# Altium project Tag105.Rev21.PrjPCB
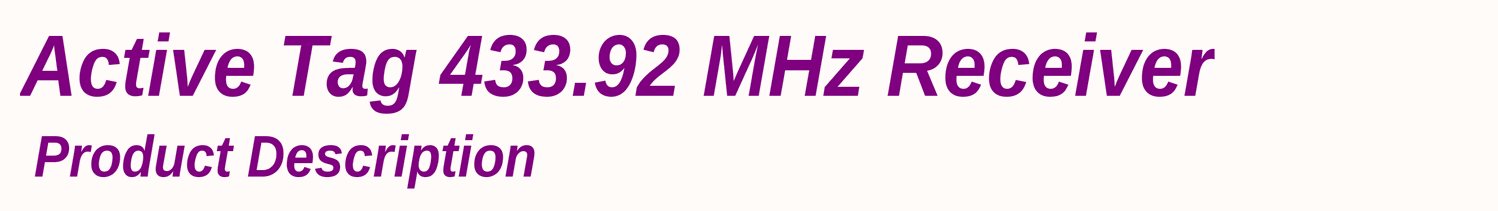
[diagram p0: PG01 Opening Page.SchDoc]
4 sheets, 91 parts. Net scope: global (net labels, ports and power ports of the same name join across sheets).
Sheets:
  PG01 Opening Page.SchDoc
  PG02 Index and Revs.SchDoc
  PG3 SHEET1.schdoc
  PG4 SHEET2.schdoc

## Sheet PG01 Opening Page.SchDoc: Opening Page
size B; Date: 2/10/2009; ApprovedBy: Touraj; DrawnBy: Juan A. Nadal; Engineer: Touraj; Organization: ActiveWave; Address1: 902 Clint Moore Rd., Suite 118; Address2: Boca Raton; Address3: FL, 33487; Address4: 561-999-9422; DocumentNumber: 1; Revision: 21; SheetNumber: 1; SheetTotal: 4; PageSetup: Record=PageOptions|CenterHorizontal=True|CenterVertical=True|PrintScale=0.68|XCorrection=1.00|YCorrection=1.00|PrintKind=0|BorderSize=5000000|LeftOffset=0|BottomOffset=0|Orientation=2|PaperLength=1000|PaperWidth=1000|Scale=100|PaperSource=7|PrintQuality=-4|MediaType=1|DitherType=10|PaperKind=Letter (8.5 x 11 in.)|PrintScaleMode=1; Project: Tag105

### Notes on the sheet
- Active Tag 433.92 MHz Receiver
- Product Description
- APPROVALS
- DATE
- Title:
- Drawn:
- Checked:
- Release:
- Date:
- Size:
- Sheet Name:
- B
- Number:
- Time:
- Revision:
- Sheet
- of
- File:

## Sheet PG02 Index and Revs.SchDoc: Index and Revisions
size B; Date: 2/10/2009; ApprovedBy: Touraj; DrawnBy: Juan A. Nadal; Engineer: Touraj; Organization: ActiveWave; Address1: 902 Clint Moore Rd., Suite 118; Address2: Boca Raton; Address3: FL, 33487; Address4: 561-999-9422; DocumentNumber: 2; Revision: 21; SheetNumber: 2; SheetTotal: 4; PageSetup: Record=PageOptions|CenterHorizontal=True|CenterVertical=True|PrintScale=0.68|XCorrection=1.00|YCorrection=1.00|PrintKind=0|BorderSize=5000000|LeftOffset=0|BottomOffset=0|Orientation=2|PaperLength=1000|PaperWidth=1000|Scale=100|PaperSource=7|PrintQuality=-4|MediaType=1|DitherType=10|PaperKind=Letter|PrintScaleMode=1; Project: Tag105
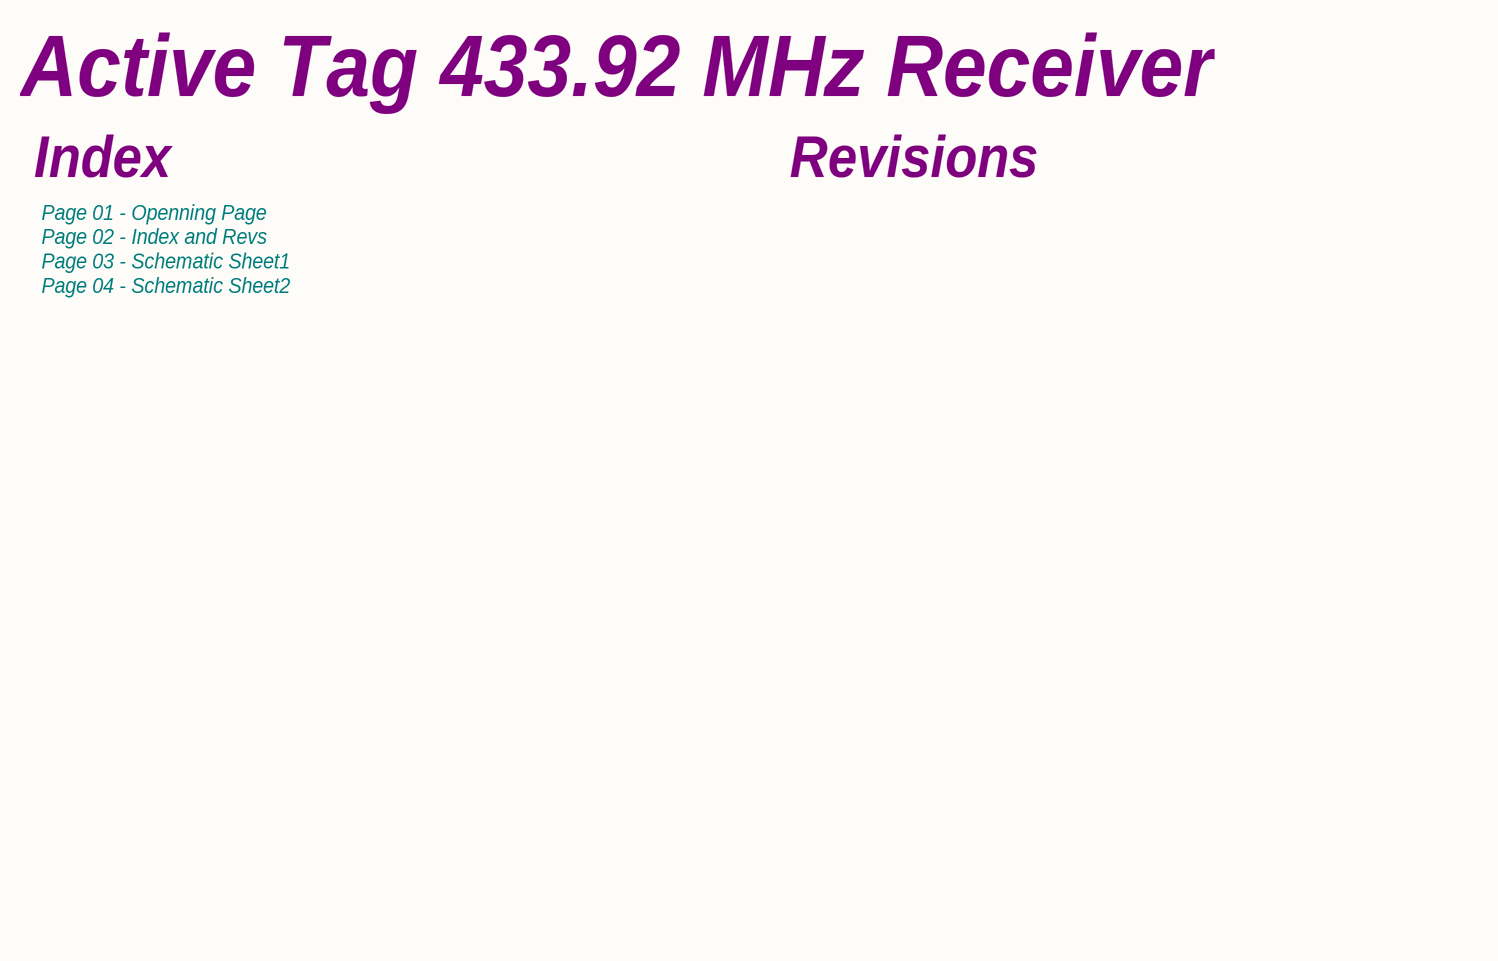
[diagram p1: PG02 Index and Revs.SchDoc]

### Notes on the sheet
- Active Tag 433.92 MHz Receiver
- Index
- Revisions
- Page 01 - Openning Page
  Page 02 - Index and Revs
  Page 03 - Schematic Sheet1
  Page 04 - Schematic Sheet2
- APPROVALS
- DATE
- Title:
- Drawn:
- Checked:
- Release:
- Date:
- Size:
- Sheet Name:
- B
- Number:
- Time:
- Revision:
- Sheet
- of
- File:

## Sheet PG3 SHEET1.schdoc
size B; Date: 2/10/2009; ApprovedBy: Touraj; DrawnBy: Juan A. Nadal; Engineer: Touraj; Organization: ActiveWave; Address1: 902 Clint Moore Rd., Suite 118; Address2: Boca Raton; Address3: FL, 33487; Address4: 561-999-9422; DocumentNumber: 3; Revision: 21; SheetNumber: 3; SheetTotal: 4; PageSetup: Record=PageOptions|CenterHorizontal=True|CenterVertical=True|PrintScale=0.70|XCorrection=1.00|YCorrection=1.00|PrintKind=0|BorderSize=5000000|LeftOffset=0|BottomOffset=0|Orientation=2|PaperLength=1000|PaperWidth=1000|Scale=100|PaperSource=7|PrintQuality=-4|MediaType=1|DitherType=10|PaperKind=Letter|PrintScaleMode=1; Project: Tag105
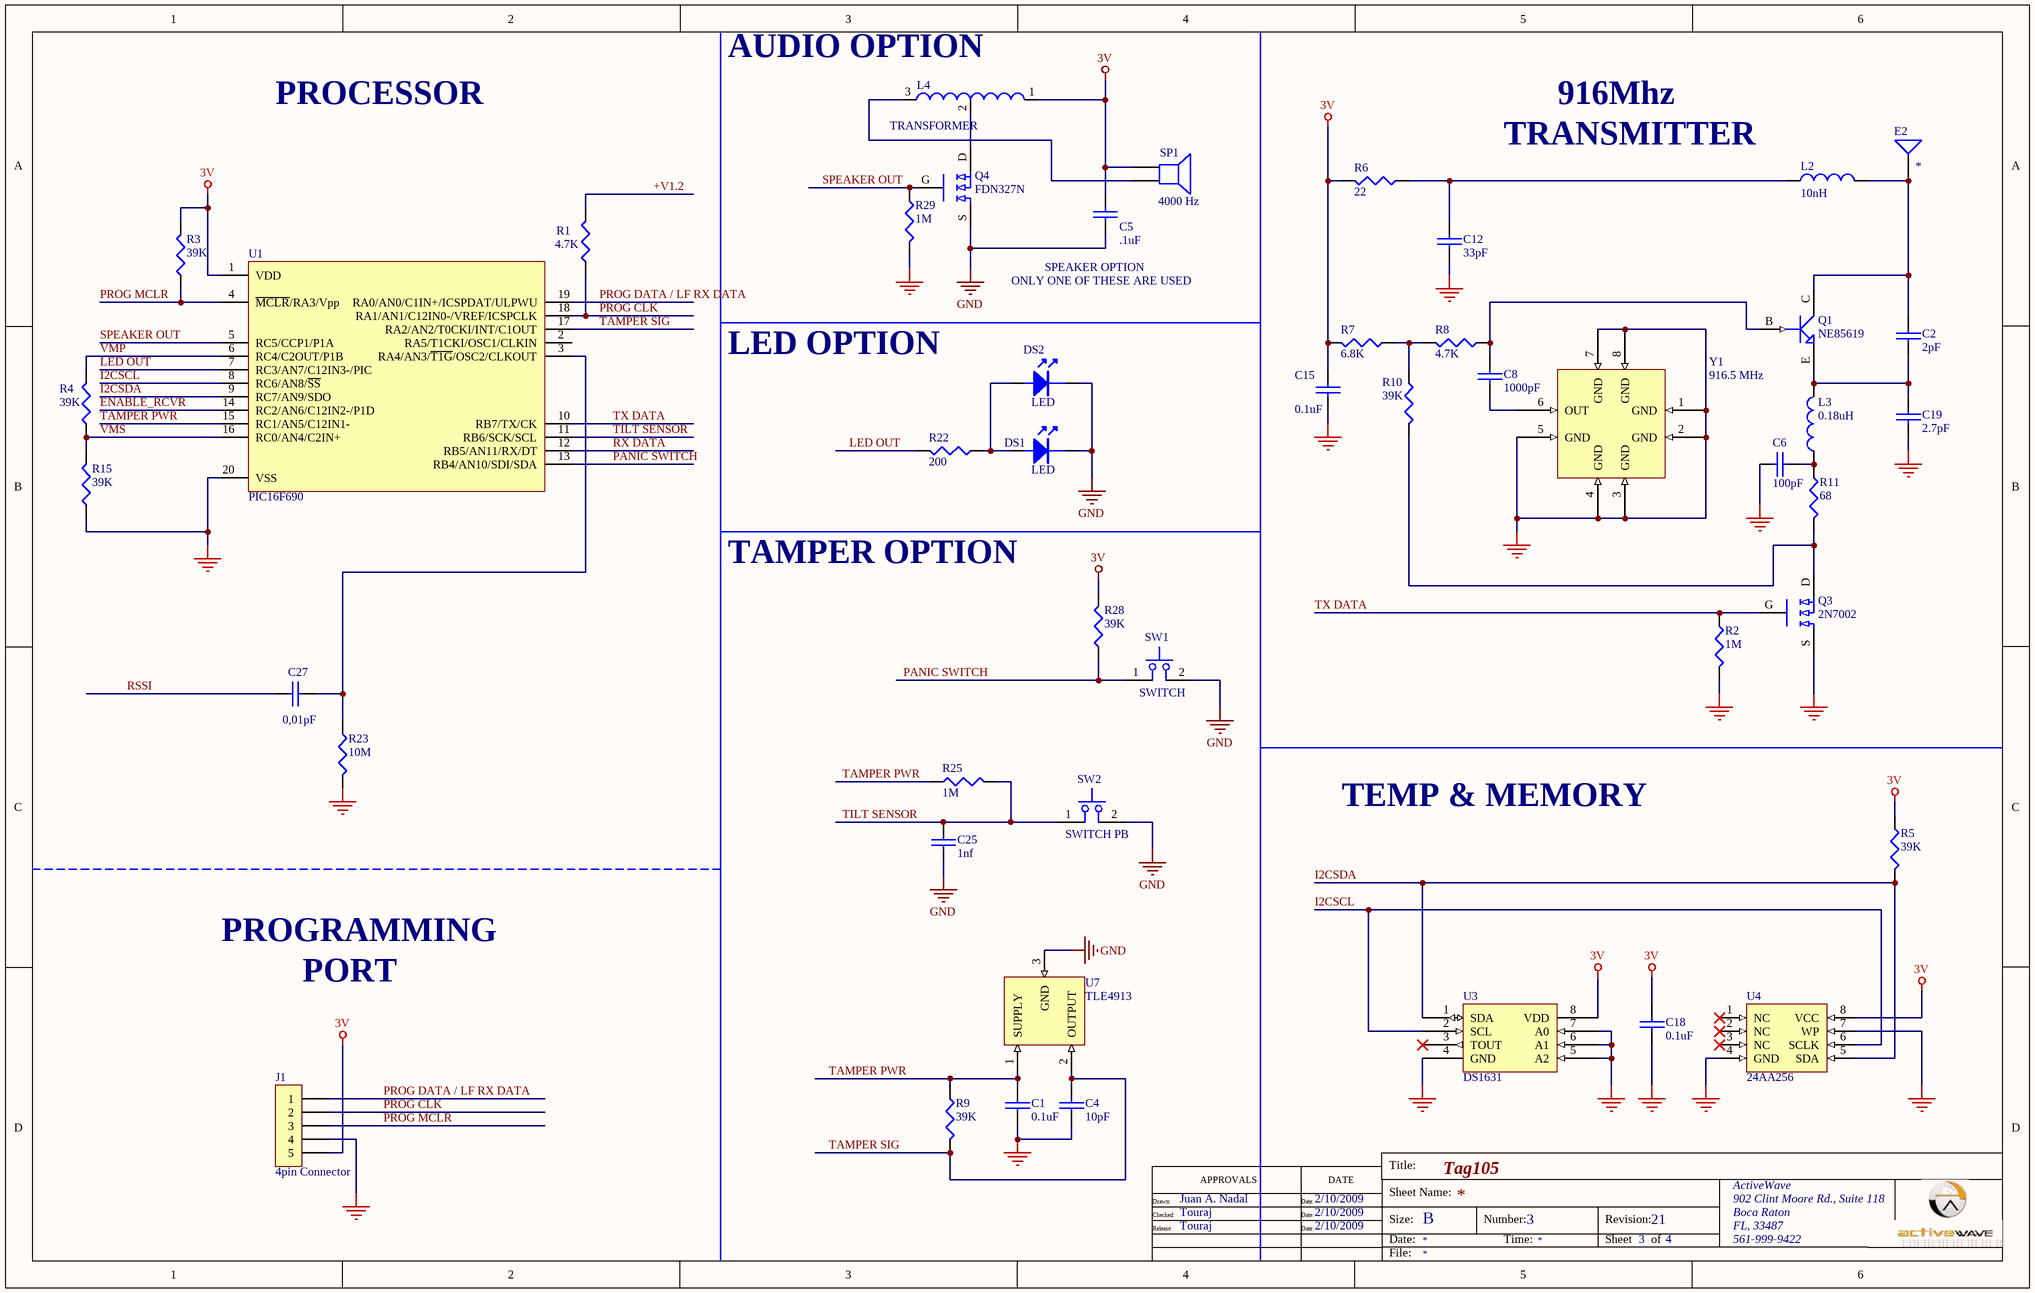
[diagram p2: PG3 SHEET1.schdoc]

### Parts
C1  0.1uF  [0603]
C2  2pF  [0603]
C4  10pF  [0603]
C5  .1uF  [0603]
C6  100pF  [0603]
C8  1000pF  [0603]
C12  33pF  [0603]
C15  0.1uF  [0603]
C18  0.1uF  [0603]
C19  2.7pF  [0603]
C25  1nf  [0603]
C27  0,01pF  [0603]
DS1  LED  [404-1032-2-ND]
DS2  LED  [LCE-358RP]
E2  *  [Antenna1]
J1  4pin Connector  [1X5 HEADER]
L2  10nH  [0603]
L3  0.18uH  [0603]
L4  TRANSFORMER  [COIL_6mmx6mm_011012]
Q1  NE85619  [3 PIN ULTRA SUPER MINI MOLD]
Q3  2N7002  [SOT23 FET]
Q4  FDN327N  [SOT23 FET]
R1  4.7K  [0603]
R2  1M
R3  39K  [0603]
R4  39K  [0603]
R5  39K  [0603]
R6  22
R7  6.8K
R8  4.7K
R9  39K  [0603]
R10  39K  [0603]
R11  68
R15  39K  [0603]
R22  200  [0603]
R23  10M  [0603]
R25  1M  [0603]
R28  39K  [0603]
R29  1M  [0603]
SP1  4000 Hz  [SPEAKER 12mmx12mm_011012]
SW1  SWITCH  [SWITCH PB REVERSED_082907]
SW2  SWITCH PB  [SQ-SEN-DUAL1]
U1  PIC16F690  [SSOP20 WIDE]
U3  DS1631  [SO8 SMALL]
U4  24AA256  [SO8]
U7  TLE4913  [SOT23W]
Y1  916.5 MHz  [RESONATOR]

### Nets
3V: C5.1 C15.1 C18.1 J1.5 L4.1 R3.2 R5.1 R6.2 R7.2 R28.2 SP1.1 U1.1(VDD) U3.8(VDD) U4.8(VCC)
GND: C1.2 C4.2 C5.2 C6.2 C12.2 C15.2 C18.2 C19.2 C25.2 DS1.K DS2.2 J1.4 Q3.S Q4.S R2.2 R15.1 R23.2 R29.2 SW1.2 SW2.2 U1.20(VSS) U3.4(GND) U3.5(A2) U3.6(A1) U3.7(A0) U4.4(GND) U4.7(WP) U7.3(GND) Y1.1(GND) Y1.2(GND) Y1.3(GND) Y1.4(GND) Y1.5(GND) Y1.7(GND) Y1.8(GND)
+V1.2: R1.2
ENABLE_RCVR: U1.14(RC2/AN6/C12IN2-/P1D)
I2CSCL: U1.8(RC6/AN8/~{SS}) U3.2(SCL) U4.6(SCLK)
I2CSDA: R5.2 U1.9(RC7/AN9/SDO) U3.1(SDA) U4.5(SDA)
LED OUT: R22.2 U1.7(RC3/AN7/C12IN3-/PIC)
PANIC SWITCH: R28.1 SW1.1 U1.13(RB4/AN10/SDI/SDA)
PROG CLK: J1.2 R1.1 U1.18(RA1/AN1/C12IN0-/VREF/ICSPCLK)
PROG DATA / LF RX DATA: J1.1 U1.19(RA0/AN0/C1IN+/ICSPDAT/ULPWU)
PROG MCLR: J1.3 R3.1 U1.4(~{MCLR}/RA3/Vpp)
RSSI: C27.1
RX DATA: U1.12(RB5/AN11/RX/DT)
SPEAKER OUT: Q4.G R29.1 U1.5(RC5/CCP1/P1A)
TAMPER PWR: C1.1 R9.1 R25.1 U1.15(RC1/AN5/C12IN1-) U7.1(SUPPLY)
TAMPER SIG: C4.1 R9.2 U1.17(RA2/AN2/T0CKI/INT/C1OUT) U7.2(OUTPUT)
TILT SENSOR: C25.1 R25.2 SW2.1 U1.11(RB6/SCK/SCL)
TX DATA: Q3.G R2.1 U1.10(RB7/TX/CK)
VMP: R4.2 U1.6(RC4/C2OUT/P1B)
VMS: R4.1 R15.2 U1.16(RC0/AN4/C2IN+)
NetC2_1: C2.1 E2.1 L2.2 Q1.C
NetC2_2: C2.2 C19.1 L3.2 Q1.E
NetC6_1: C6.1 L3.1 R11.1
NetC8_1: C8.1 Q1.B R8.1
NetC8_2: C8.2 Y1.6(OUT)
NetC12_1: C12.1 L2.1 R6.1
NetC27_2: C27.2 R23.1 U1.3(RA4/AN3/~{T1G}/OSC2/CLKOUT)
NetDS1_A: DS1.A DS2.1 R22.1
NetL4_2: L4.2 Q4.D
NetL4_3: L4.3 SP1.2
NetQ3_D: Q3.D R10.2 R11.2
NetR7_1: R7.1 R8.2 R10.1

Not connected (* = marked no-connect by the designer): U1 2(RA5/T1CKI/OSC1/CLKIN); U3 3(TOUT)*; U4 1(NC)* 2(NC)* 3(NC)*

### Notes on the sheet
- (near L4) AUDIO OPTION
- PROCESSOR
- TRANSMITTER
- 916Mhz
- ONLY ONE OF THESE ARE USED
- (near C5) SPEAKER OPTION
- LED OPTION
- TAMPER OPTION
- TEMP & MEMORY
- PROGRAMMING
- PORT
- APPROVALS
- DATE
- Title:
- Drawn:
- Checked:
- Release:
- Date:
- Size:
- Sheet Name:
- B
- Number:
- Time:
- Revision:
- Sheet
- of
- File:

### Library data of the parts
C1 C2 C4-C6 C8 C12 C15 C18 C19 C25 C27 = CAP-0603: Capacitor; ACTIVEWAVE-P/N: *; ITEM-DESCRIPTION: *; MANUFACTURER: *; MFGR-P/N: *
  C1 C15 C18: VALUE: 0.1uF
  C2: VALUE: 2pF
  C4: VALUE: 10pF
  C5: VALUE: .1uF
  C6: VALUE: 100pF
  C8: VALUE: 1000pF
  C12: VALUE: 33pF
  C19: VALUE: 2.7pF
  C25: VALUE: 1nf
  C27: VALUE: 0,01pF
DS2 = LCE-358RP: X-Bring Red Power SMD LED Emitter; MANUFACTURER: L.C. LED; ACTIVEWAVE-P/N: *; ITEM-DESCRIPTION: X-Bring Red Power SMD LED Emitter; MFGR-P/N: LCE-358RP; Value: LED
E2 = Antenna1: VALUE: *
J1 = CON5-1: Connector; ACTIVEWAVE-P/N: *; ITEM-DESCRIPTION: *; MANUFACTURER: *; MFGR-P/N: *; VALUE: 4pin Connector
L2 L3 = INDUCTOR: ACTIVEWAVE-P/N: *; ITEM-DESCRIPTION: *; MANUFACTURER: *; MFGR-P/N: *
  L2: VALUE: 10nH
  L3: VALUE: 0.18uH
L4 = INDUCTOR_V2: VALUE: TRANSFORMER
Q1 = NE85619: TRANSISTOR NPN 1GHZ SMD; MANUFACTURER: ??????; ACTIVEWAVE-P/N: *; ITEM-DESCRIPTION: TRANSISTOR NPN 1GHZ SMD; MFGR-P/N: ??????; VALUE: NE85619
Q3 = 2N7002: N-CHANNEL ENHANCEMENT MODE FIELD EFFECT TRANSISTOR; MANUFACTURER: FAIRCHILD; ACTIVEWAVE-P/N: *; ITEM-DESCRIPTION: N-CHANNEL ENHANCEMENT MODE FIELD EFFECT TRANSISTOR; MFGR-P/N: 2N7002; VALUE: 2N7002
Q4 = FDN327N: 20V N-Channel MOSFET; MANUFACTURER: FAIRCHILD; ITEM-DESCRIPTION: N-CHANNEL 1.8 VGS SPECIFIED POWERTRENCH MOSFET; ACTIVEWAVE-P/N: *; MFGR-P/N: FDN327N; VALUE: FDN327N
R1 = RESISTOR: Text Field1: 20; Text Field2: 30
R2 R6-R8 R11 R29 = RES-0402: ACTIVEWAVE-P/N: *; MFGR-P/N: *; MANUFACTURER: *; ITEM-DESCRIPTION: *
  R2 R29: VALUE: 1M
  R6: VALUE: 22
  R7: VALUE: 6.8K
  R8: VALUE: 4.7K
  R11: VALUE: 68
R3-R5 R9 R10 R15 R22 R23 R25 R28 = RES-0603: ACTIVEWAVE-P/N: *; MFGR-P/N: *; MANUFACTURER: *; ITEM-DESCRIPTION: *
  R3-R5 R9 R10 R15 R28: VALUE: 39K
  R22: VALUE: 200
  R23: VALUE: 10M
  R25: VALUE: 1M
SP1 = SMT-1028-S-R: Surface Mount Transducer; MANUFACTURER: PUI Audio; ITEM-DESCRIPTION: Audio Indicators & Alerts EM 98dB 2830H 3.6Vpp; ACTIVEWAVE-P/N: *; MFGR-P/N: CMT-1203; VALUE: 4000 Hz
U1 = PIC16F690-E/P: Microcontrollers (MCU) 7KB FL 256R 18 I/O; MANUFACTURER: Microchip; ACTIVEWAVE-P/N: *; ITEM-DESCRIPTION: Microcontrollers (MCU) 7KB FL 256R 18 I/O; MFGR-P/N: PIC16F690-E/P; VALUE: PIC16F690
U3 = DS1631: High-Precision Digital Thermometer and Thermostat; MANUFACTURER: DALLAS SEMICONDUCTOR; MFGR-P/N: ??????; ACTIVEWAVE-P/N: *; ITEM-DECRIPTION: High-Precision Digital Thermometer and Thermostat; VALUE: DS1631
U4 = 24AA256-I/P: 24AA256 32k Microchip Serial EEPROM; ACTIVEWAVE-P/N: *; MFGR-P/N: 24AA256-I/P; MANUFACTURER: Microchip; ITEM-DESCRIPTION: 24AA256 32k Microchip Serial EEPROM; VALUE: 24AA256
U7 = TLE4913: Low Power Hall Switch; MANUFACTURER: Infineon Technologies AG; ACTIVEWAVE-P/N: *; ITEM-DESCRIPTION: Low Power Hall Switch; MFGR-P/N: TLE4913; VALUE: TLE4913
Y1 = RESONATOR: 916.5 MHz Saw Resonator; MANUFACTURER: ??????; ACTIVEWAVE-P/N: *; ITEM-DESCRIPTION: 916.5 MHz Saw Resonator; MFGR-P/N: ??????; VALUE: 916.5 MHz
DS1 = LED: ACTIVEWAVE-P/N: *; ITEM-DESCRIPTION: *; MANUFACTURER: *; MFGR-P/N: *; VALUE: LED
SW1 = SWITCH: ACTIVEWAVE-P/N: *; ITEM-DESCRIPTION: *; MANUFACTURER: *; MFGR-P/N: *; VALUE: SWITCH
SW2 = SWITCH PB: ACTIVEWAVE-P/N: *; ITEM-DESCRIPTION: *; MANUFACTURER: *; MFGR-P/N: *; VALUE: SWITCH PB

## Sheet PG4 SHEET2.schdoc
size B; Date: 2/10/2009; ApprovedBy: Touraj; DrawnBy: Juan A. Nadal; Engineer: Touraj; Organization: ActiveWave; Address1: 902 Clint Moore Rd., Suite 118; Address2: Boca Raton; Address3: FL, 33487; Address4: 561-999-9422; DocumentNumber: 4; Revision: 21; SheetNumber: 4; SheetTotal: 4; PageSetup: Record=PageOptions|CenterHorizontal=True|CenterVertical=True|PrintScale=0.70|XCorrection=1.00|YCorrection=1.00|PrintKind=0|BorderSize=5000000|LeftOffset=0|BottomOffset=0|Orientation=2|PaperLength=1000|PaperWidth=1000|Scale=100|PaperSource=7|PrintQuality=-4|MediaType=1|DitherType=10|PaperKind=Letter|PrintScaleMode=1; Project: Tag105
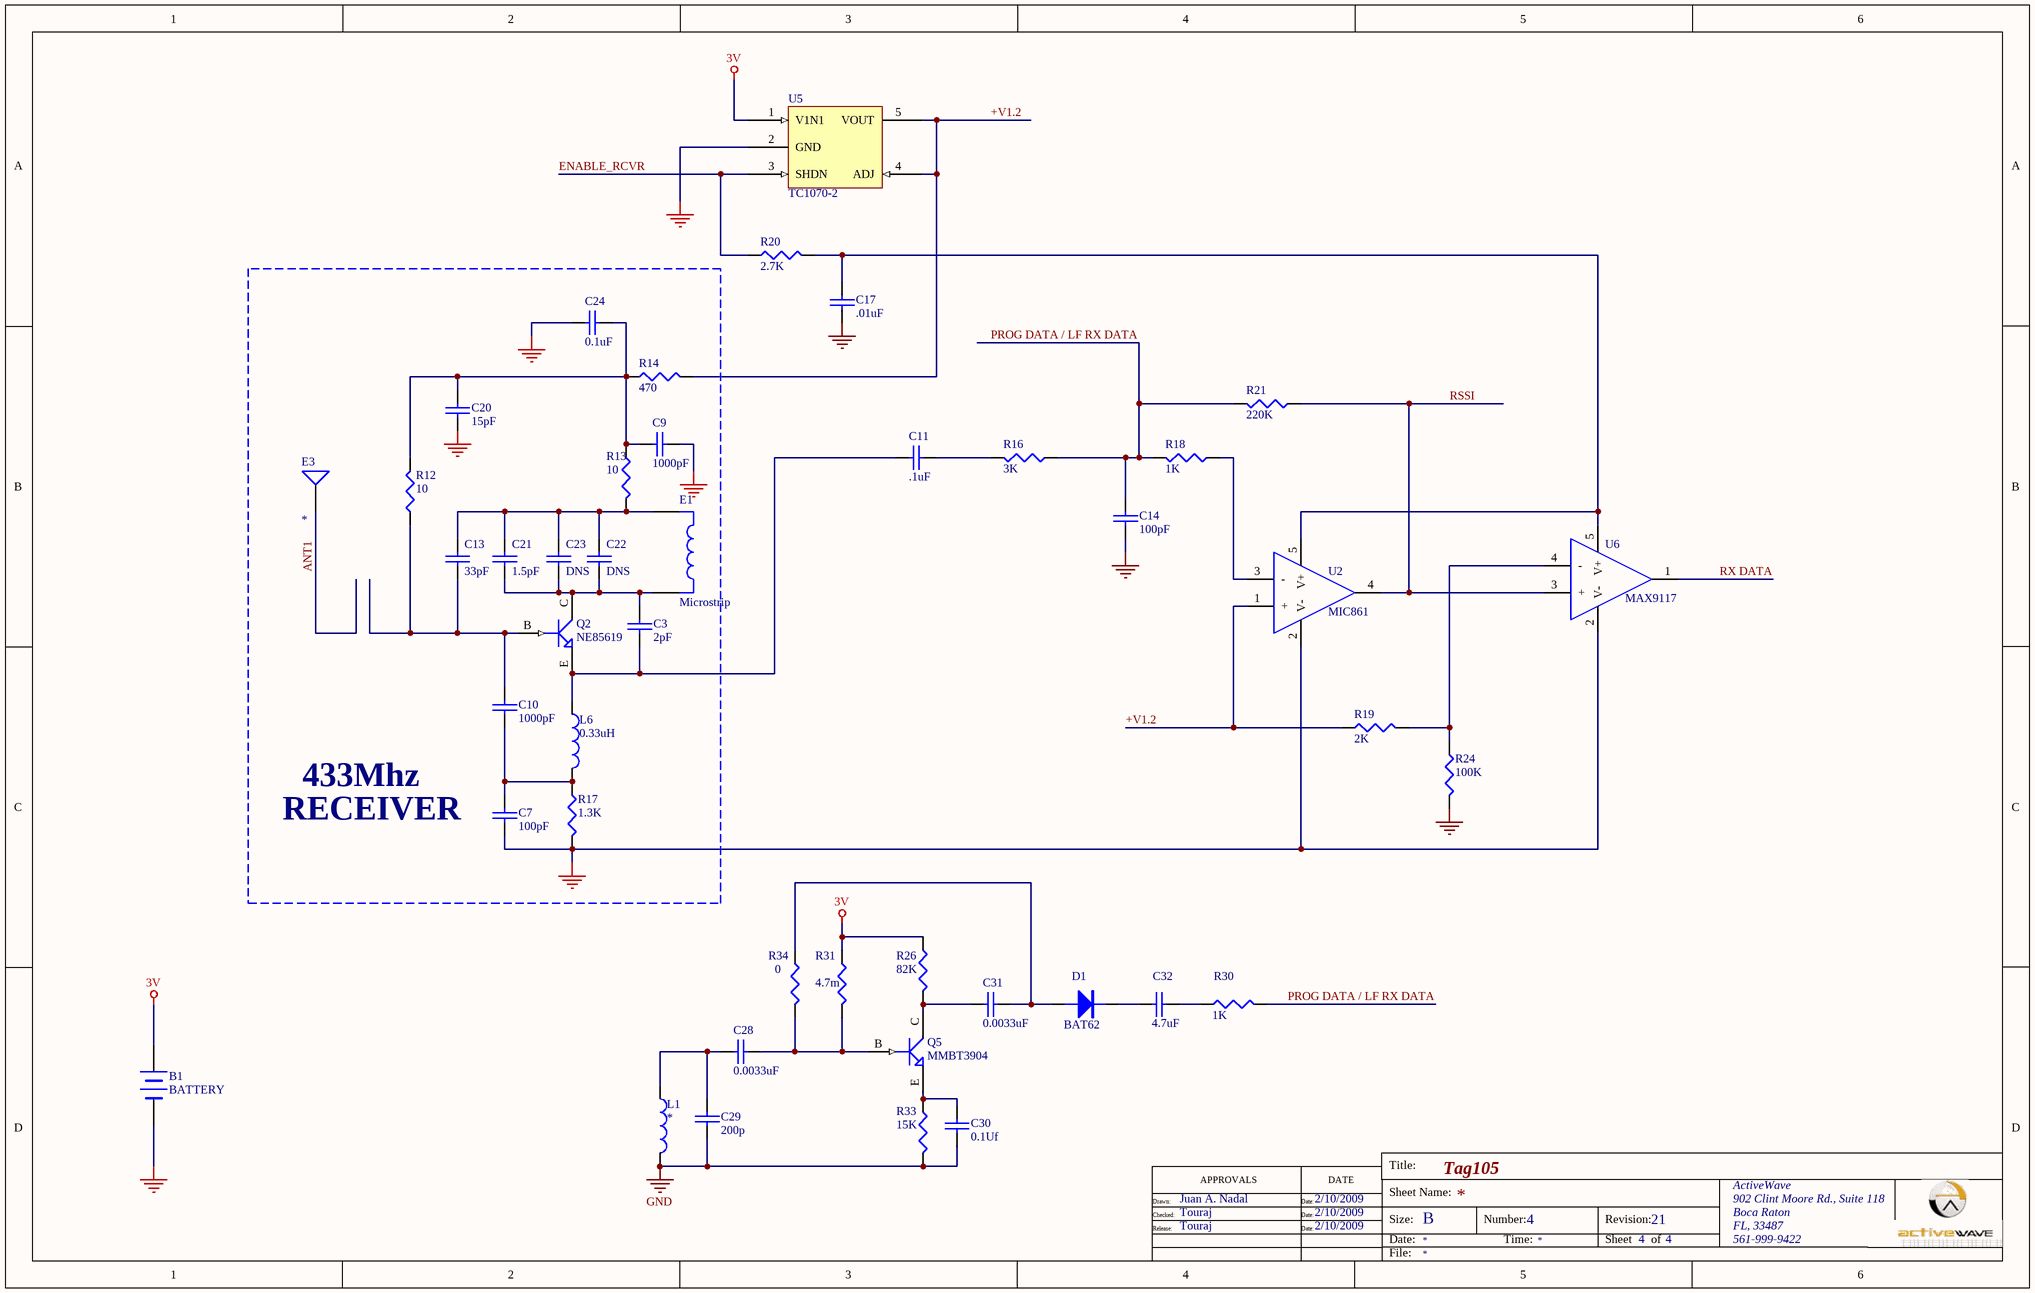
[diagram p3: PG4 SHEET2.schdoc]

### Parts
B1  BATTERY  [BATT HOLDER COIN CR2032 CUT]
C3  2pF  [0603]
C7  100pF  [0603]
C9  1000pF  [0603]
C10  1000pF  [0603]
C11  .1uF  [0603]
C13  33pF  [0603]
C14  100pF  [0603]
C17  .01uF  [0603]
C20  15pF  [0603]
C21  1.5pF  [0603]
C22  DNS  [0603]
C23  DNS  [0603]
C24  0.1uF  [0603]
C28  0.0033uF  [0603]
C29  200p  [0603]
C30  0.1Uf  [0603]
C31  0.0033uF  [0603]
C32  4.7uF  [0603]
D1  BAT62  [SMCR_SOD323_V1]
E1  Microstrip  [Antenna]  (net tie, no BOM)
E3  *  [Antenna1]
L1  *  [4308RV]
L6  0.33uH  [0603]
Q2  NE85619  [3 PIN ULTRA SUPER MINI MOLD]
Q5  MMBT3904  [SOT23-EBC]
R12  10  [0603]
R13  10  [0603]
R14  470  [0603]
R16  3K  [0603]
R17  1.3K  [0603]
R18  1K  [0603]
R19  2K  [0603]
R20  2.7K  [0603]
R21  220K  [0603]
R24  100K  [0603]
R26  82K  [0603]
R30  1K  [0603]
R31  4.7m  [0603]
R33  15K  [0603]
R34  0  [0603]
U2  MIC861  [SC70]
U5  TC1070-2  [SOT23-5A]
U6  MAX9117  [SC70]

### Nets
3V: B1.2(+) R26.1 R31.1 U5.1(V1N1)
GND: B1.1(-) C7.2 C9.2 C14.1 C17.2 C20.2 C24.2 C29.1 C30.1 L1.2 R17.2 R24.2 R33.2 U2.2(V-) U5.2(GND) U6.2(V-)
+V1.2: R14.2 R19.1 U2.1(+) U5.4(ADJ) U5.5(VOUT)
ANT1: E3.1
ENABLE_RCVR: R20.1 U5.3(SHDN)
PROG DATA / LF RX DATA: C14.2 R16.1 R18.2 R21.2 R30.2
RSSI: R21.1 U2.4(OUT) U6.3(+)
RX DATA: U6.1(OUT)
NetC3_1: C3.1 C21.2 C22.2 C23.2 E1.1 Q2.C
NetC3_2: C3.2 C11.1 L6.1 Q2.E
NetC7_1: C7.1 C10.2 L6.2 R17.1
NetC9_1: C9.1 C20.1 C24.1 R12.2 R13.1 R14.1
NetC10_1: C10.1 C13.2 Q2.B R12.1
NetC11_2: C11.2 R16.2
NetC13_1: C13.1 C21.1 C22.1 C23.1 E1.2 R13.2
NetC17_1: C17.1 R20.2 U2.5(V+) U6.5(V+)
NetC28_1: C28.1 C29.2 L1.1
NetC28_2: C28.2 Q5.B R31.2 R34.2
NetC30_2: C30.2 Q5.E R33.1
NetC31_1: C31.1 Q5.C R26.2
NetC31_2: C31.2 D1.A R34.1
NetC32_1: C32.1 D1.K
NetC32_2: C32.2 R30.1
NetR18_1: R18.1 U2.3(-)
NetR19_2: R19.2 R24.1 U6.4(-)

### Notes on the sheet
- RECEIVER
- 433Mhz
- APPROVALS
- DATE
- Title:
- Drawn:
- Checked:
- Release:
- Date:
- Size:
- Sheet Name:
- B
- Number:
- Time:
- Revision:
- Sheet
- of
- File:

### Library data of the parts
C3 C7 C9-C11 C13 C14 C17 C20-C24 C28-C32 = CAP-0603: Capacitor; ACTIVEWAVE-P/N: *; ITEM-DESCRIPTION: *; MANUFACTURER: *; MFGR-P/N: *
  C3: VALUE: 2pF
  C7 C14: VALUE: 100pF
  C9 C10: VALUE: 1000pF
  C11: VALUE: .1uF
  C13: VALUE: 33pF
  C17: VALUE: .01uF
  C20: VALUE: 15pF
  C21: VALUE: 1.5pF
  C22 C23: VALUE: DNS
  C24: VALUE: 0.1uF
  C28 C31: VALUE: 0.0033uF
  C29: VALUE: 200p
  C30: VALUE: 0.1Uf
  C32: VALUE: 4.7uF
D1 = DIODE: ACTIVEWAVE-P/N: *; ITEM-DESCRIPTION: *; MANUFACTURER: *; MFGR-P/N: *; VALUE: BAT62
E1 = ANTENNA: PART-VALUE: *; ITEM-DESCRIPTION: Microstrip
E3 = Antenna1: VALUE: *
L1 = INDUCTOR_V1: ACTIVEWAVE-P/N: *; ITEM-DESCRIPTION: *; MANUFACTURER: *; MFGR-P/N: *; VALUE: *
L6 = INDUCTOR: ACTIVEWAVE-P/N: *; ITEM-DESCRIPTION: *; MANUFACTURER: *; MFGR-P/N: *; VALUE: 0.33uH
Q2 = NE85619: as Q1 on sheet PG3 SHEET1; ACTIVEWAVE-P/N: *; ITEM-DESCRIPTION: TRANSISTOR NPN 1GHZ SMD; MFGR-P/N: ??????; VALUE: NE85619
Q5 = MMBT3904: NPN SWITCHING TRANSTOR; MANUFACTURER: ??????; ITEM-DESCRIPTION: TRANSISTOR NPN 1GHZ SMD; ACTIVEWAVE-P/N: *; MFGR-P/N: ??????; VALUE: MMBT3904
R12-R14 R16-R21 R24 R26 R30 R31 R33 R34 = RES-0603: ACTIVEWAVE-P/N: *; MFGR-P/N: *; MANUFACTURER: *; ITEM-DESCRIPTION: *
  R12 R13: VALUE: 10
  R14: VALUE: 470
  R16: VALUE: 3K
  R17: VALUE: 1.3K
  R18 R30: VALUE: 1K
  R19: VALUE: 2K
  R20: VALUE: 2.7K
  R21: VALUE: 220K
  R24: VALUE: 100K
  R26: VALUE: 82K
  R31: VALUE: 4.7m
  R33: VALUE: 15K
  R34: VALUE: 0
U2 = MIC861BC5: Ultra Low Power Op Amp; MANUFACTURER: MICREL; ACTIVEWAVE-P/N: *; ITEM-DESCRIPTION: Ultra Low Power Op Amp; MFGR-P/N: MIC861BC5; VALUE: MIC861
U5 = TC1070-2: Adjustable CMOS LDOs with Shutdown; MANUFACTURER: Microchip Technology; ITEM-DESCRIPTION: 50mA, 100mA and 150mA Adjustable CMOS LDOs with Shutdown; MFGR-P/N: TC1070; ACTIVEWAVE-P/N: *; VALUE: TC1070-2
U6 = COMPARATOR MAX9117: MAX9117 Comparators; MANUFACTURER: MAXIM; ITEM-DESCRIPTION: SC70, 1.6V, Nanopower, Beyond-the-Rails Comparators With/Without Reference; MFGR-P/N: ??????; ACTIVEWAVE-P/N: *; VALUE: MAX9117
B1 = BATTERY: ACTIVEWAVE-P/N: *; ITEM-DESCRIPTION: *; MANUFACTURER: *; MFGR-P/N: *; VALUE: BATTERY

## Nets that join several sheets
3V: PG3 SHEET1 (14 pins), PG4 SHEET2 (B1.2 R26.1 R31.1 U5.1)
GND: PG3 SHEET1 (35 pins), PG4 SHEET2 (16 pins)
+V1.2: PG3 SHEET1 (R1.2), PG4 SHEET2 (5 pins)
ENABLE_RCVR: PG3 SHEET1 (U1.14), PG4 SHEET2 (R20.1 U5.3)
PROG DATA / LF RX DATA: PG3 SHEET1 (J1.1 U1.19), PG4 SHEET2 (5 pins)
RSSI: PG3 SHEET1 (C27.1), PG4 SHEET2 (R21.1 U2.4 U6.3)
RX DATA: PG3 SHEET1 (U1.12), PG4 SHEET2 (U6.1)